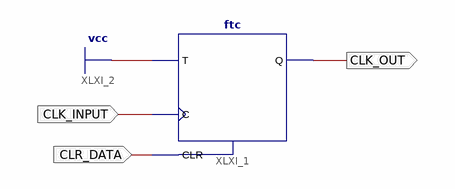
[diagram p0: schematic sheet 1]
// Xilinx ISE schematic TWO_DIV.sch (spartan6) as structural Verilog: 1 symbols, 3 ports
module TWO_DIV (
  input  CLK_INPUT,
  input  CLR_DATA,
  output CLK_OUT
);

  ftc XLXI_1 (.C(CLK_INPUT), .CLR(CLR_DATA), .T(1'b1), .Q(CLK_OUT));
endmodule
